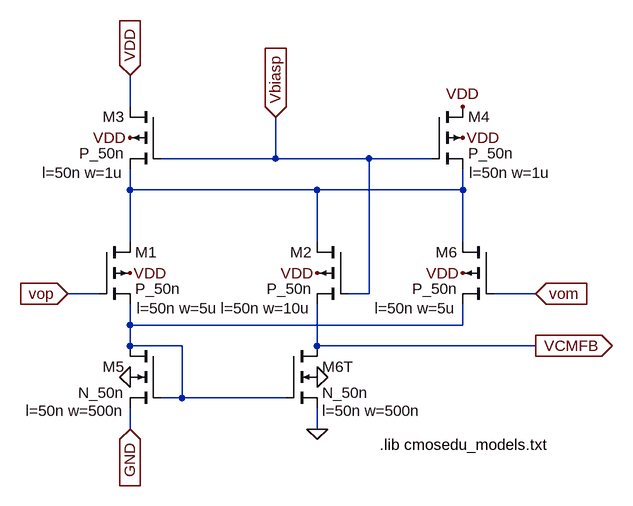
[diagram p0: schematic Fig_26_9.asc]
Fig_26_9.asc, the LTspice schematic file:
Version 4
SHEET 1 2684 680
WIRE 1136 -96 1088 -96
WIRE 1184 -384 1184 -432
WIRE 1184 -256 1184 -288
WIRE 1184 -176 1184 -256
WIRE 1184 -48 1184 -80
WIRE 1184 -16 1184 -48
WIRE 1184 112 1184 80
WIRE 1264 -16 1184 -16
WIRE 1264 64 1232 64
WIRE 1264 64 1264 -16
WIRE 1408 -304 1232 -304
WIRE 1408 -304 1408 -368
WIRE 1424 64 1264 64
WIRE 1472 -256 1184 -256
WIRE 1472 -176 1472 -256
WIRE 1472 -16 1472 -80
WIRE 1472 112 1472 80
WIRE 1552 -304 1408 -304
WIRE 1552 -96 1520 -96
WIRE 1552 -96 1552 -304
WIRE 1648 -304 1552 -304
WIRE 1696 -256 1472 -256
WIRE 1696 -256 1696 -288
WIRE 1696 -176 1696 -256
WIRE 1696 -48 1184 -48
WIRE 1696 -48 1696 -80
WIRE 1808 -96 1744 -96
WIRE 1808 -16 1472 -16
FLAG 1472 112 0
FLAG 1696 -384 VDD
FLAG 1696 -336 VDD
FLAG 1184 -336 VDD
FLAG 1472 32 0
FLAG 1184 32 0
FLAG 1184 -128 VDD
FLAG 1472 -128 VDD
FLAG 1696 -128 VDD
FLAG 1408 -368 Vbiasp
IOPIN 1408 -368 In
FLAG 1184 -432 VDD
IOPIN 1184 -432 In
FLAG 1088 -96 vop
IOPIN 1088 -96 In
FLAG 1808 -96 vom
IOPIN 1808 -96 In
FLAG 1808 -16 VCMFB
IOPIN 1808 -16 Out
FLAG 1184 112 GND
IOPIN 1184 112 In
SYMBOL pmos4 1648 -384 R0
WINDOW 123 58 102 Left 0
WINDOW 0 56 16 Left 0
SYMATTR Value2 l=50n w=1u
SYMATTR InstName M4
SYMATTR Value P_50n
SYMBOL pmos4 1232 -384 M0
WINDOW 123 58 102 Left 0
WINDOW 0 56 16 Left 0
SYMATTR Value2 l=50n w=1u
SYMATTR InstName M3
SYMATTR Value P_50n
SYMBOL nmos4 1424 -16 R0
WINDOW 123 56 100 Left 0
SYMATTR Value2 l=50n w=500n
SYMATTR InstName M6T
SYMATTR Value N_50n
SYMBOL nmos4 1232 -16 M0
WINDOW 123 56 100 Left 0
SYMATTR Value2 l=50n w=500n
SYMATTR InstName M5
SYMATTR Value N_50n
SYMBOL pmos4 1136 -176 R0
WINDOW 123 58 102 Left 0
WINDOW 0 56 16 Left 0
SYMATTR Value2 l=50n w=5u
SYMATTR InstName M1
SYMATTR Value P_50n
SYMBOL pmos4 1520 -176 M0
WINDOW 123 58 102 Left 0
WINDOW 0 56 16 Left 0
SYMATTR Value2 l=50n w=10u
SYMATTR InstName M2
SYMATTR Value P_50n
SYMBOL pmos4 1744 -176 M0
WINDOW 123 58 102 Left 0
WINDOW 0 56 16 Left 0
SYMATTR Value2 l=50n w=5u
SYMATTR InstName M6
SYMATTR Value P_50n
TEXT 1568 136 Left 0 !.lib cmosedu_models.txt

The netlist it stands for:
* Fig_26_9.asc
M4 VDD Vbiasp N001 VDD P_50n l=50n w=1u
M3 VDD Vbiasp N001 VDD P_50n l=50n w=1u
M6T VCMFB N002 0 0 N_50n l=50n w=500n
M5 N002 N002 GND 0 N_50n l=50n w=500n
M1 N001 vop N002 VDD P_50n l=50n w=5u
M2 N001 Vbiasp VCMFB VDD P_50n l=50n w=10u
M6 N001 vom N002 VDD P_50n l=50n w=5u
.model NMOS NMOS
.model PMOS PMOS
.lib standard.mos
.lib cmosedu_models.txt
.backanno
.end